# Altium schematic sheet cell_simulator.SchDoc
size C
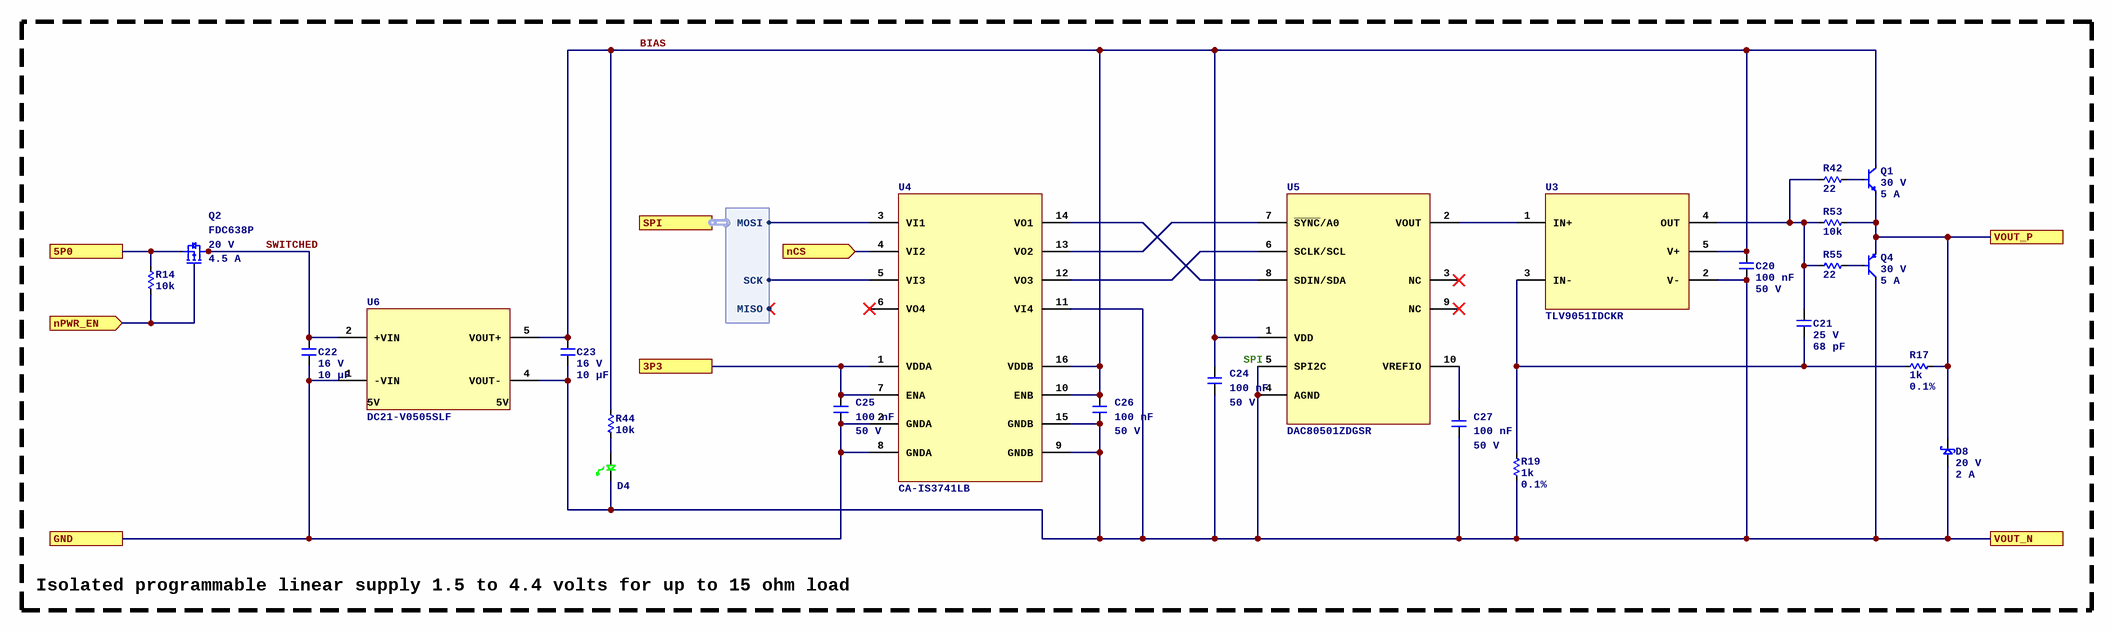
[diagram p0: cell_simulator.SchDoc]

## Parts
C20  Capacitance: 100 nF  Voltage Rating: 50 V  [C0402]  (hidden comment: CL05B104KB54PNC)
C21  Voltage Rating: 25 V  Capacitance: 68 pF  [C0402]  (hidden comment: CBR04C680F3GAC)
C22  Voltage Rating: 16 V  Capacitance: 10 µF  [C0805]  (hidden comment: CL21B106KOQNNNE)
C23  Voltage Rating: 16 V  Capacitance: 10 µF  [C0805]  (hidden comment: CL21B106KOQNNNE)
C24  Capacitance: 100 nF  Voltage Rating: 50 V  [C0402]  (hidden comment: CL05B104KB54PNC)
C25  Capacitance: 100 nF  Voltage Rating: 50 V  [C0402]  (hidden comment: CL05B104KB54PNC)
C26  Capacitance: 100 nF  Voltage Rating: 50 V  [C0402]  (hidden comment: CL05B104KB54PNC)
C27  Capacitance: 100 nF  Voltage Rating: 50 V  [C0402]  (hidden comment: CL05B104KB54PNC)
D4  LTST-C190GKT  [LED_0603P_GREEN]  (value not drawn)
D8  Vr: 20 V  Current: 2 A  [ESMP]  (hidden comment: MSS2P2-M3/89A)
Q1  Voltage: 30 V  Current: 5 A  [TO-252-3]  (hidden comment: 2SCR572D3TL1)
Q2  FDC638P  Voltage: 20 V  Current: 4.5 A  [6SOT23]
Q4  Voltage: 30 V  Current: 5 A  [TO-252-3]  (hidden comment: 2SAR572D3TL1)
R14  value 10k  [R0402]  (hidden comment: 0402WGF1002TCE)
R17  value 1k  Tolerance: 0.1%  [R0402]  (hidden comment: ERA2AEB102X)
R19  value 1k  Tolerance: 0.1%  [R0402]  (hidden comment: ERA2AEB102X)
R42  value 22  [R0402]  (hidden comment: 0402WGF220JTCE)
R44  value 10k  [R0402]  (hidden comment: 0402WGF1002TCE)
R53  value 10k  [R0402]  (hidden comment: 0402WGF1002TCE)
R55  value 22  [R0402]  (hidden comment: 0402WGF220JTCE)
U3  TLV9051IDCKR  [5SC70]
U4  CA-IS3741LB  [16SSOP635]
U5  DAC80501ZDGSR  [TI_DGS]
U6  DC21-V0505SLF  [HALO_DC21]

## Blocks framed on the sheet
SPI: C20-C27 D4 D8 Q1 Q2 Q4 R14 R17 R19 R42 R44 R53 R55 U3-U6

## Ports
3P3, 5P0, GND, nCS (in), nPWR_EN (in), SPI (harness SPI), VOUT_N, VOUT_P

## Harnesses
SPI: MISO, SCK, MOSI

## Nets
3P3: C25.1 U4.1(VDDA) U4.7(ENA) ; port 3P3
5P0: Q2.4 R14.2 ; port 5P0
BIAS: C20.1 C23.1 C24.1 C26.1 Q1.4(C) R44.2 U3.5(V+) U4.10(ENB) U4.16(VDDB) U5.1(VDD) U6.5(VOUT+)
GND: C22.2 C25.2 U4.2(GNDA) U4.8(GNDA) U6.1(-VIN) ; port GND
nCS: U4.4(VI2) ; port nCS
nPWR_EN: Q2.3 R14.1 ; port nPWR_EN
SWITCHED: C22.1 Q2.1 Q2.2 Q2.5 Q2.6 U6.2(+VIN)
VOUT_N: C20.2 C23.2 C24.2 C26.2 C27.2 D4.2 D8.1 Q4.4(C) R19.1 U3.2(V-) U4.9(GNDB) U4.11(VI4) U4.15(GNDB) U5.4(AGND) U5.5(SPI2C) U6.4(VOUT-) ; port VOUT_N
VOUT_P: D8.2 Q1.3(E) Q4.3(E) R17.1 R53.1 ; port VOUT_P
NetC21_1: C21.1 R42.2 R53.2 R55.2 U3.4(OUT)
NetC21_2: C21.2 R17.2 R19.2 U3.3(IN-)
NetC27_1: C27.1 U5.10(VREFIO)
NetD4_1: D4.1 R44.1
NetQ1_1: Q1.1(B) R42.1
NetQ4_1: Q4.1(B) R55.1
NetU3_1: U3.1(IN+) U5.2(VOUT)
NetU4_3: U4.3(VI1) ; port SPI.MOSI
NetU4_5: U4.5(VI3) ; port SPI.SCK
NetU4_12: U4.12(VO3) U5.6(SCLK/SCL)
NetU4_13: U4.13(VO2) U5.7(~{SYNC}/A0)
NetU4_14: U4.14(VO1) U5.8(SDIN/SDA)

Not connected (* = marked no-connect by the designer): U4 6(VO4)*; U5 3(NC)* 9(NC)*

## Notes on the sheet
- Isolated programmable linear supply 1.5 to 4.4 volts for up to 15 ohm load
- (in symbol DC21-V0505SLF) 5V

## Library data of the parts
C20 C24-C27 = CL05B104KB54PNC: Manufacturer: Samsung Electro-Mechanics; Dielectric: X7R; ComponentLink1URL: https://wmsc.lcsc.com/wmsc/upload/file/pdf/v2/lcsc/2304140030_Samsung-Electro-Mechanics-CL05B104KB54PNC_C307331.pdf; ComponentLink1Description: Datasheet; Manufacturer Part Number: CL05B104KB54PNC; Package: 0402; Supplier 2: LCSC; Supplier Part Number 2: C307331
C21 = CBR04C680F3GAC: Manufacturer: KEMET; Dielectric: C0G; Manufacturer Part Number: CBR04C680F3GAC; Package: 0402; Supplier 2: LCSC; Supplier Part Number 2: C3831342; ComponentLink1Description: Datasheet; ComponentLink1URL: https://wmsc.lcsc.com/wmsc/upload/file/pdf/v2/lcsc/2401181509_KEMET-CBR04C680F3GAC_C3831342.pdf
C22 C23 = CL21B106KOQNNNE: Manufacturer: Samsung Electro-Mechanics; Dielectric: X7R; Manufacturer Part Number: CL21B106KOQNNNE; Package: 0805; Supplier 2: LCSC; Supplier Part Number 2: C95841; ComponentLink1Description: Datasheet; ComponentLink1URL: https://wmsc.lcsc.com/wmsc/upload/file/pdf/v2/lcsc/2304140030_Samsung-Electro-Mechanics-CL21B106KOQNNNE_C95841.pdf
D4 = LTST-C190GKT: LED GREEN CLEAR 0603 SMD; Manufacturer: Lite-On Inc; Vf: 2.0 V; If: 20 mA; Supplier 1: DigiKey; Manufacturer Part Number: LTST-C190GKT; ComponentLink1URL: https://static.chipdip.ru/lib/459/DOC011459654.pdf; ComponentLink1Description: Datasheet; Supplier Part Number 1: 160-1183-1-ND; Supplier 2: LCSC; Supplier Part Number 2: C125093; LED Color: Green; Supplier 3: Mouser; Supplier Part Number 3: 859-LTST-C190GKT
D8 = MSS2P2-M3/89A: DIODE SCHOTTKY 20V 2A MICROSMP; Manufacturer: Vishay Semiconductor Diodes Division; Supplier 1: DigiKey; ComponentLink1URL: http://www.vishay.com/docs/89054/mss2p3.pdf; Supplier Part Number 1: MSS2P2-M3/89AGICT-ND; Manufacturer Part Number: MSS2P2-M3/89A; ComponentLink1Description: Datasheet; Supplier 2: LCSC; Supplier Part Number 2: C2978531; Diode Type: Schottky; Supplier 3: Mouser; Supplier Part Number 3: 625-MSS2P2-M3
Q1 = 2SCR572D3TL1: NPN power transistor, 30 V, 5 A, low VCE(sat), TO-252-3; Manufacturer: ROHM Semiconductor; Manufacturer Part Number: 2SCR572D3TL1; Polarity: NPN; Supplier 1: DigiKey; Supplier Part Number 1: 2SCR572D3TL1CT-ND; Supplier 2: LCSC; Supplier Part Number 2: C3018572; Supplier 3: Mouser; Supplier Part Number 3: 755-2SCR572D3TL1; ComponentLink1Description: Datasheet; ComponentLink1URL: https://fscdn.rohm.com/en/products/databook/datasheet/discrete/transistor/bipolar/2scr572d3tl1-e.pdf
Q2 = FDC638P: MOSFET P-CH 20V 4.5A SSOT-6; Manufacturer: onsemi; Channel Type: P-channel; Supplier 1: DigiKey; ComponentLink1URL: https://www.onsemi.com/pdf/datasheet/fdc638p-d.pdf; ComponentLink1Description: Datasheet; Supplier Part Number 1: FDC638PCT-ND; Manufacturer Part Number: FDC638P; Supplier 2: LCSC; Supplier Part Number 2: C241772; Supplier 3: Mouser; Supplier Part Number 3: 512-FDC638P
Q4 = 2SAR572D3TL1: PNP power transistor, 30 V, 5 A, low VCE(sat), TO-252-3; Manufacturer: ROHM Semiconductor; Manufacturer Part Number: 2SAR572D3TL1; Polarity: PNP; Supplier 1: DigiKey; Supplier Part Number 1: 2SAR572D3TL1CT-ND; Supplier 2: LCSC; Supplier Part Number 2: C5336541; Supplier 3: Mouser; Supplier Part Number 3: 755-2SAR572D3TL1; ComponentLink1Description: Datasheet; ComponentLink1URL: https://fscdn.rohm.com/en/products/databook/datasheet/discrete/transistor/bipolar/2sar572d3tl1-e.pdf
R14 R44 = 0402WGF1002TCE: Manufacturer: UNI-ROYAL(Uniroyal Elec); Tolerance: 1%; Temperature Coefficient: ±100ppm/?; Power Rating (mW): 62.5; ComponentLink1Description: Datasheet; ComponentLink1URL: https://wmsc.lcsc.com/wmsc/upload/file/pdf/v2/lcsc/2206010100_UNI-ROYAL-Uniroyal-Elec-0402WGF1002TCE_C25744.pdf; Manufacturer Part Number: 0402WGF1002TCE; Package: 0402; Supplier 2: LCSC; Supplier Part Number 2: C25744
R17 R19 = ERA2AEB102X: Manufacturer: PANASONIC; Power Rating (mW): 63; Temperature Coefficient: ±25ppm/?; Manufacturer Part Number: ERA2AEB102X; Package: 0402; Supplier 2: LCSC; Supplier Part Number 2: C445596; ComponentLink1Description: Datasheet; ComponentLink1URL: https://wmsc.lcsc.com/wmsc/upload/file/pdf/v2/lcsc/2404151006_PANASONIC-ERA2AEB102X_C445596.pdf
R42 R55 = 0402WGF220JTCE: Manufacturer: UNI-ROYAL(Uniroyal Elec); Power Rating (mW): 62.5; Tolerance: 1%; Temperature Coefficient: ±100ppm/?; Manufacturer Part Number: 0402WGF220JTCE; Package: 0402; Supplier 2: LCSC; Supplier Part Number 2: C25092; ComponentLink1Description: Datasheet; ComponentLink1URL: https://wmsc.lcsc.com/wmsc/upload/file/pdf/v2/lcsc/2205311900_UNI-ROYAL-Uniroyal-Elec-0402WGF220JTCE_C25092.pdf
R53 = 0402WGF1002TCE: Manufacturer: UNI-ROYAL(Uniroyal Elec); Power Rating (mW): 62.5; Tolerance: 1%; Temperature Coefficient: ±100ppm/?; Manufacturer Part Number: 0402WGF1002TCE; Package: 0402; Supplier 2: LCSC; Supplier Part Number 2: C25744; ComponentLink1Description: Datasheet; ComponentLink1URL: https://wmsc.lcsc.com/wmsc/upload/file/pdf/v2/lcsc/2206010100_UNI-ROYAL-Uniroyal-Elec-0402WGF1002TCE_C25744.pdf
U3 = TLV9051IDCKR: Single 5 MHz rail-to-rail input/output operational amplifier, 15 V/µs slew rate, SC70-5; Manufacturer: Texas Instruments; Supplier 1: DigiKey; Supplier Part Number 1: 296-TLV9051IDCKRCT-ND; Manufacturer Part Number: TLV9051IDCKR; Supplier Part Number 2: C2873238; ComponentLink1Description: Datasheet; ComponentLink1URL: https://www.ti.com/lit/ds/symlink/tlv9051.pdf; Supplier 2: LCSC; Supplier 3: Mouser; Supplier Part Number 3: 595-TLV9051IDCKR
U4 = CA-IS3741LB: 150Mbps 150kV/µs 2.5V~5.5V 2.5V~5.5V 3 3750 Low Level SSOP-16-150mil Digital Isolators ROHS; Manufacturer: Chipanalog; Manufacturer Part Number: CA-IS3741LB; Supplier 2: LCSC; Supplier Part Number 2: C3202820; ComponentLink1Description: Datasheet; ComponentLink1URL: https://e.chipanalog.com/Public/Uploads/uploadfile/files/20250123/CAIS374xdatasheetVersion1.08en20241217.pdf
U5 = DAC80501ZDGSR: 16 Bit Digital to Analog Converter 1 10-VSSOP, zero output at startup; Manufacturer: Texas Instruments; Manufacturer Part Number: DAC80501ZDGSR; Supplier 1: DigiKey; ComponentLink1Description: Datasheet; ComponentLink1URL: https://www.ti.com/lit/ds/symlink/dac80501.pdf; Supplier 2: LCSC; Supplier Part Number 2: C1852033; Supplier Part Number 1: 296-DAC80501ZDGSRCT-ND; Supplier 3: Mouser; Supplier Part Number 3: 595-DAC80501ZDGSR
U6 = DC21-V0505SLF: Isolated Module DC DC Converter 1 Output 5V 400mA 4.5V - 5.5V Input; Manufacturer: HALO Electronics, Inc.; Supplier 1: DigiKey; Supplier Part Number 1: 5843-DC21-V0505SLF-ND; Manufacturer Part Number: DC21-V0505SLF; ComponentLink1Description: Datasheet; ComponentLink1URL: https://www.haloelectronics.com/pdf/dc-converter-1w2w.pdf; Supplier 3: Mouser; Supplier Part Number 3: 493-DC21-V0505SLF